# Altium schematic sheet Eth2Mil1553_Quad_Artix7.SchDoc: STM32 MPU2 - Artix 7 Device Template
size A; SheetNumber: 1; SheetTotal: 14
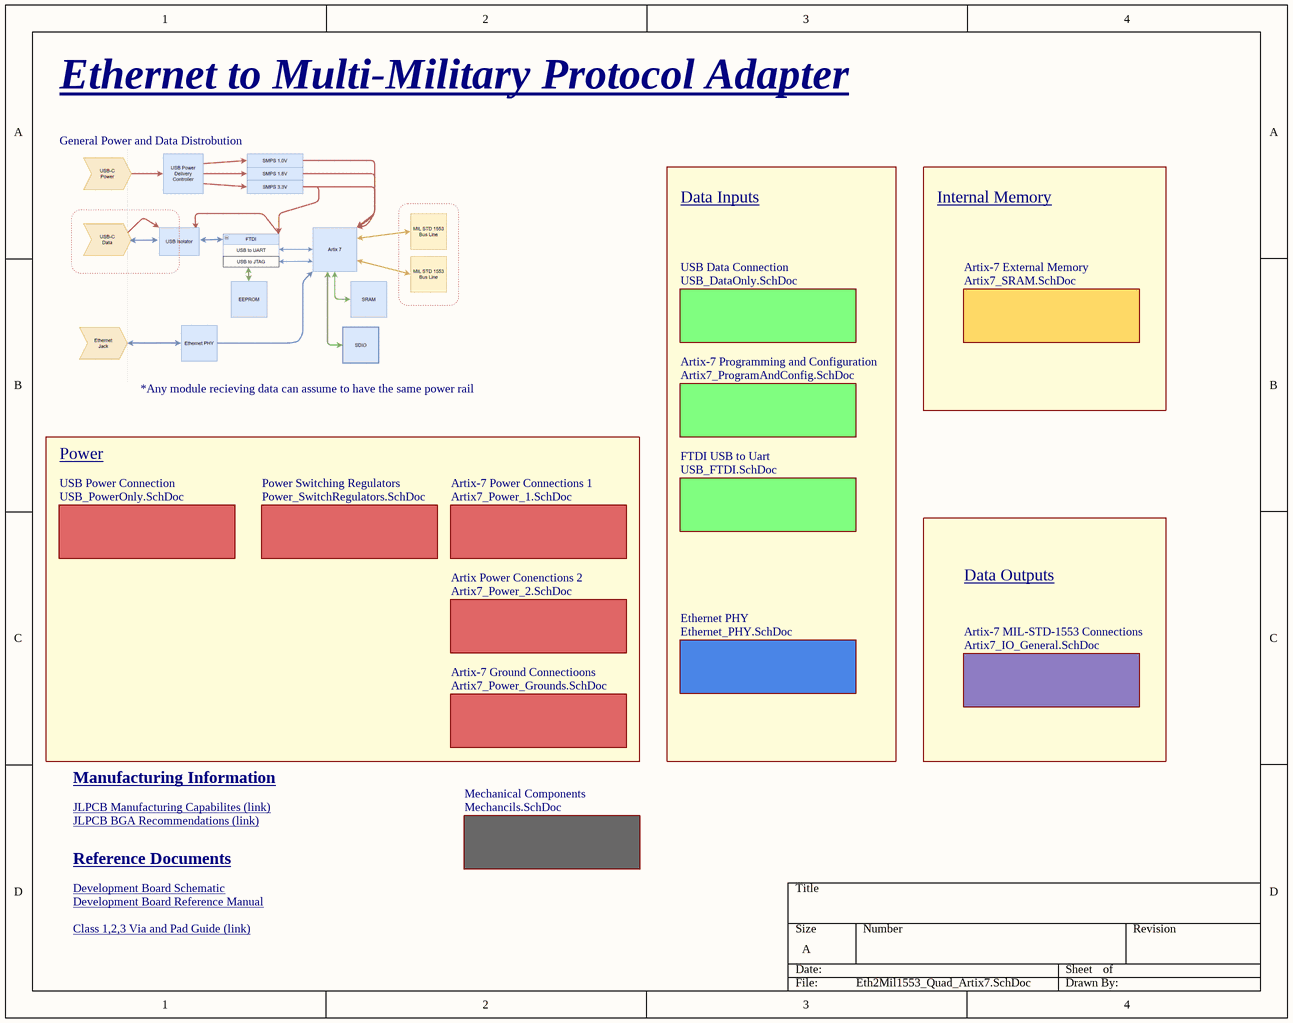
[diagram p0: Eth2Mil1553_Quad_Artix7.SchDoc]

## Sub-sheets
Artix Power Conenctions 2 = Artix7_Power_2.SchDoc: no entries
Artix-7 External Memory = Artix7_SRAM.SchDoc: no entries
Artix-7 Ground Connectioons = Artix7_Power_Grounds.SchDoc: no entries
Artix-7 MIL-STD-1553 Connections = Artix7_IO_General.SchDoc: no entries
Artix-7 Power Connections 1 = Artix7_Power_1.SchDoc: no entries
Artix-7 Programming and Configuration = Artix7_ProgramAndConfig.SchDoc: no entries
Ethernet PHY = Ethernet_PHY.SchDoc: no entries
FTDI USB to Uart = USB_FTDI.SchDoc: no entries
Mechanical Components = Mechancils.SchDoc: no entries
Power Switching Regulators = Power_SwitchRegulators.SchDoc: no entries
USB Data Connection = USB_DataOnly.SchDoc: no entries
USB Power Connection = USB_PowerOnly.SchDoc: no entries

## Notes on the sheet
- Ethernet to Multi-Military Protocol Adapter
- General Power and Data Distrobution
- Data Inputs
- Internal Memory
- *Any module recieving data can assume to have the same power rail
- Power
- Data Outputs
- JLPCB Manufacturing Capabilites (link) <https://jlcpcb.com/capabilities/pcb-capabilities>
- Manufacturing Information
- JLPCB BGA Recommendations (link) <https://jlcpcb.com/help/article/BGA-Design-Guidelines---PCB-Layout-Recommendations-for-BGA-packages>
- Reference Documents
- Development Board Schematic <https://digilent.com/reference/_media/reference/programmable-logic/cmod-a7/cmod_a7_sch_rev_c0.pdf?_gl=1*qkxv5u*_gcl_au*MjAxOTQ5MDM5OS4xNzQ2MzA4ODg3*_ga*MTA3MTgyNDA3MS4xNzQ0ODY4ODUx*_ga_JSPEFFCPBT*czE3NDc5NTE0MjMkbzQkZzEkdDE3NDc5NTE0MzAkajUzJGwwJGgxNjE3MDA2NTU0JGRWWFB3c3o4VGxNS2E4azhxR0phdjBGWmxjNUNlb0pRdkNR>
- Development Board Reference Manual <https://digilent.com/reference/programmable-logic/cmod-a7/reference-manual?redirect=1>
- Class 1,2,3 Via and Pad Guide (link) <https://resources.altium.com/p/pcb-size-and-pad-size-guidelines>